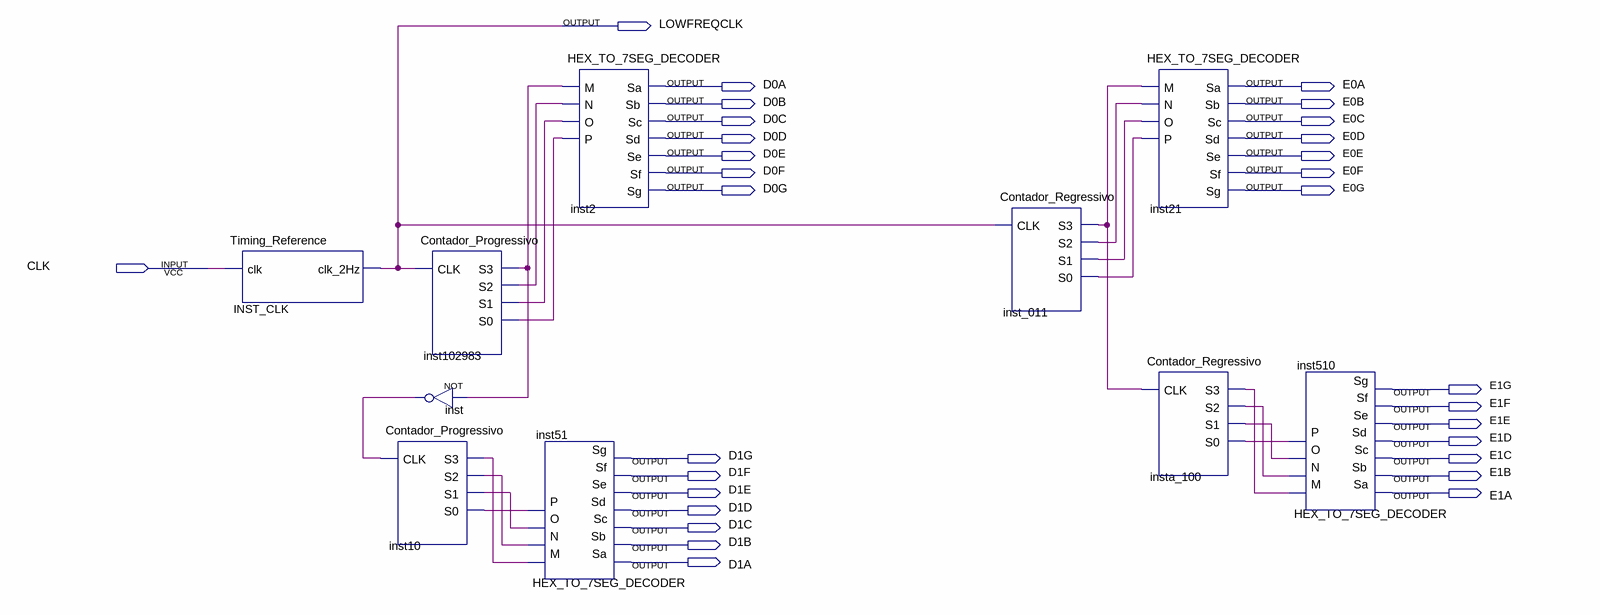
[diagram p0: schematic sheet]
// Quartus schematic Lab02.bdf as structural Verilog: 10 symbols, 30 pins
module Lab02 (
  input  CLK,
  output LOWFREQCLK,
  output D0A,
  output E0A,
  output D0B,
  output E0B,
  output D0C,
  output E0C,
  output D0D,
  output E0D,
  output D0E,
  output E0E,
  output D0F,
  output E0F,
  output D0G,
  output E0G,
  output E1G,
  output E1F,
  output E1E,
  output E1D,
  output D1G,
  output E1C,
  output D1F,
  output E1B,
  output D1E,
  output E1A,
  output D1D,
  output D1C,
  output D1B,
  output D1A
);

  wire inst10_s0, inst10_s1, inst10_s2, inst10_s3, inst102983_s0, inst102983_s1, inst102983_s2,
       inst102983_s3, inst_011_s0, inst_011_s1, inst_011_s2, inst_011_s3, inst_out, insta_100_s0,
       insta_100_s1, insta_100_s2, insta_100_s3;

  Timing_Reference INST_CLK (.clk(CLK), .clk_2Hz(LOWFREQCLK));
  Contador_Progressivo inst102983 (
    .CLK(LOWFREQCLK), .S3(inst102983_s3), .S2(inst102983_s2), .S1(inst102983_s1), .S0(inst102983_s0));
  not inst (inst_out, inst102983_s3);
  Contador_Progressivo inst10 (.CLK(inst_out), .S3(inst10_s3), .S2(inst10_s2), .S1(inst10_s1), .S0(inst10_s0));
  HEX_TO_7SEG_DECODER inst2 (
    .M(inst102983_s3), .N(inst102983_s2), .O(inst102983_s1), .P(inst102983_s0), .Sa(D0A), .Sb(D0B), .Sc(D0C),
    .Sd(D0D), .Se(D0E), .Sf(D0F), .Sg(D0G));
  HEX_TO_7SEG_DECODER inst51 (
    .M(inst10_s3), .N(inst10_s2), .O(inst10_s1), .P(inst10_s0), .Sa(D1A), .Sb(D1B), .Sc(D1C), .Sd(D1D),
    .Se(D1E), .Sf(D1F), .Sg(D1G));
  Contador_Regressivo inst_011 (
    .CLK(LOWFREQCLK), .S3(inst_011_s3), .S2(inst_011_s2), .S1(inst_011_s1), .S0(inst_011_s0));
  HEX_TO_7SEG_DECODER inst21 (
    .M(inst_011_s3), .N(inst_011_s2), .O(inst_011_s1), .P(inst_011_s0), .Sa(E0A), .Sb(E0B), .Sc(E0C),
    .Sd(E0D), .Se(E0E), .Sf(E0F), .Sg(E0G));
  Contador_Regressivo insta_100 (
    .CLK(inst_011_s3), .S3(insta_100_s3), .S2(insta_100_s2), .S1(insta_100_s1), .S0(insta_100_s0));
  HEX_TO_7SEG_DECODER inst510 (
    .M(insta_100_s3), .N(insta_100_s2), .O(insta_100_s1), .P(insta_100_s0), .Sa(E1A), .Sb(E1B), .Sc(E1C),
    .Sd(E1D), .Se(E1E), .Sf(E1F), .Sg(E1G));
endmodule
